# Altium schematic sheet iotv3.SchDoc
size A3
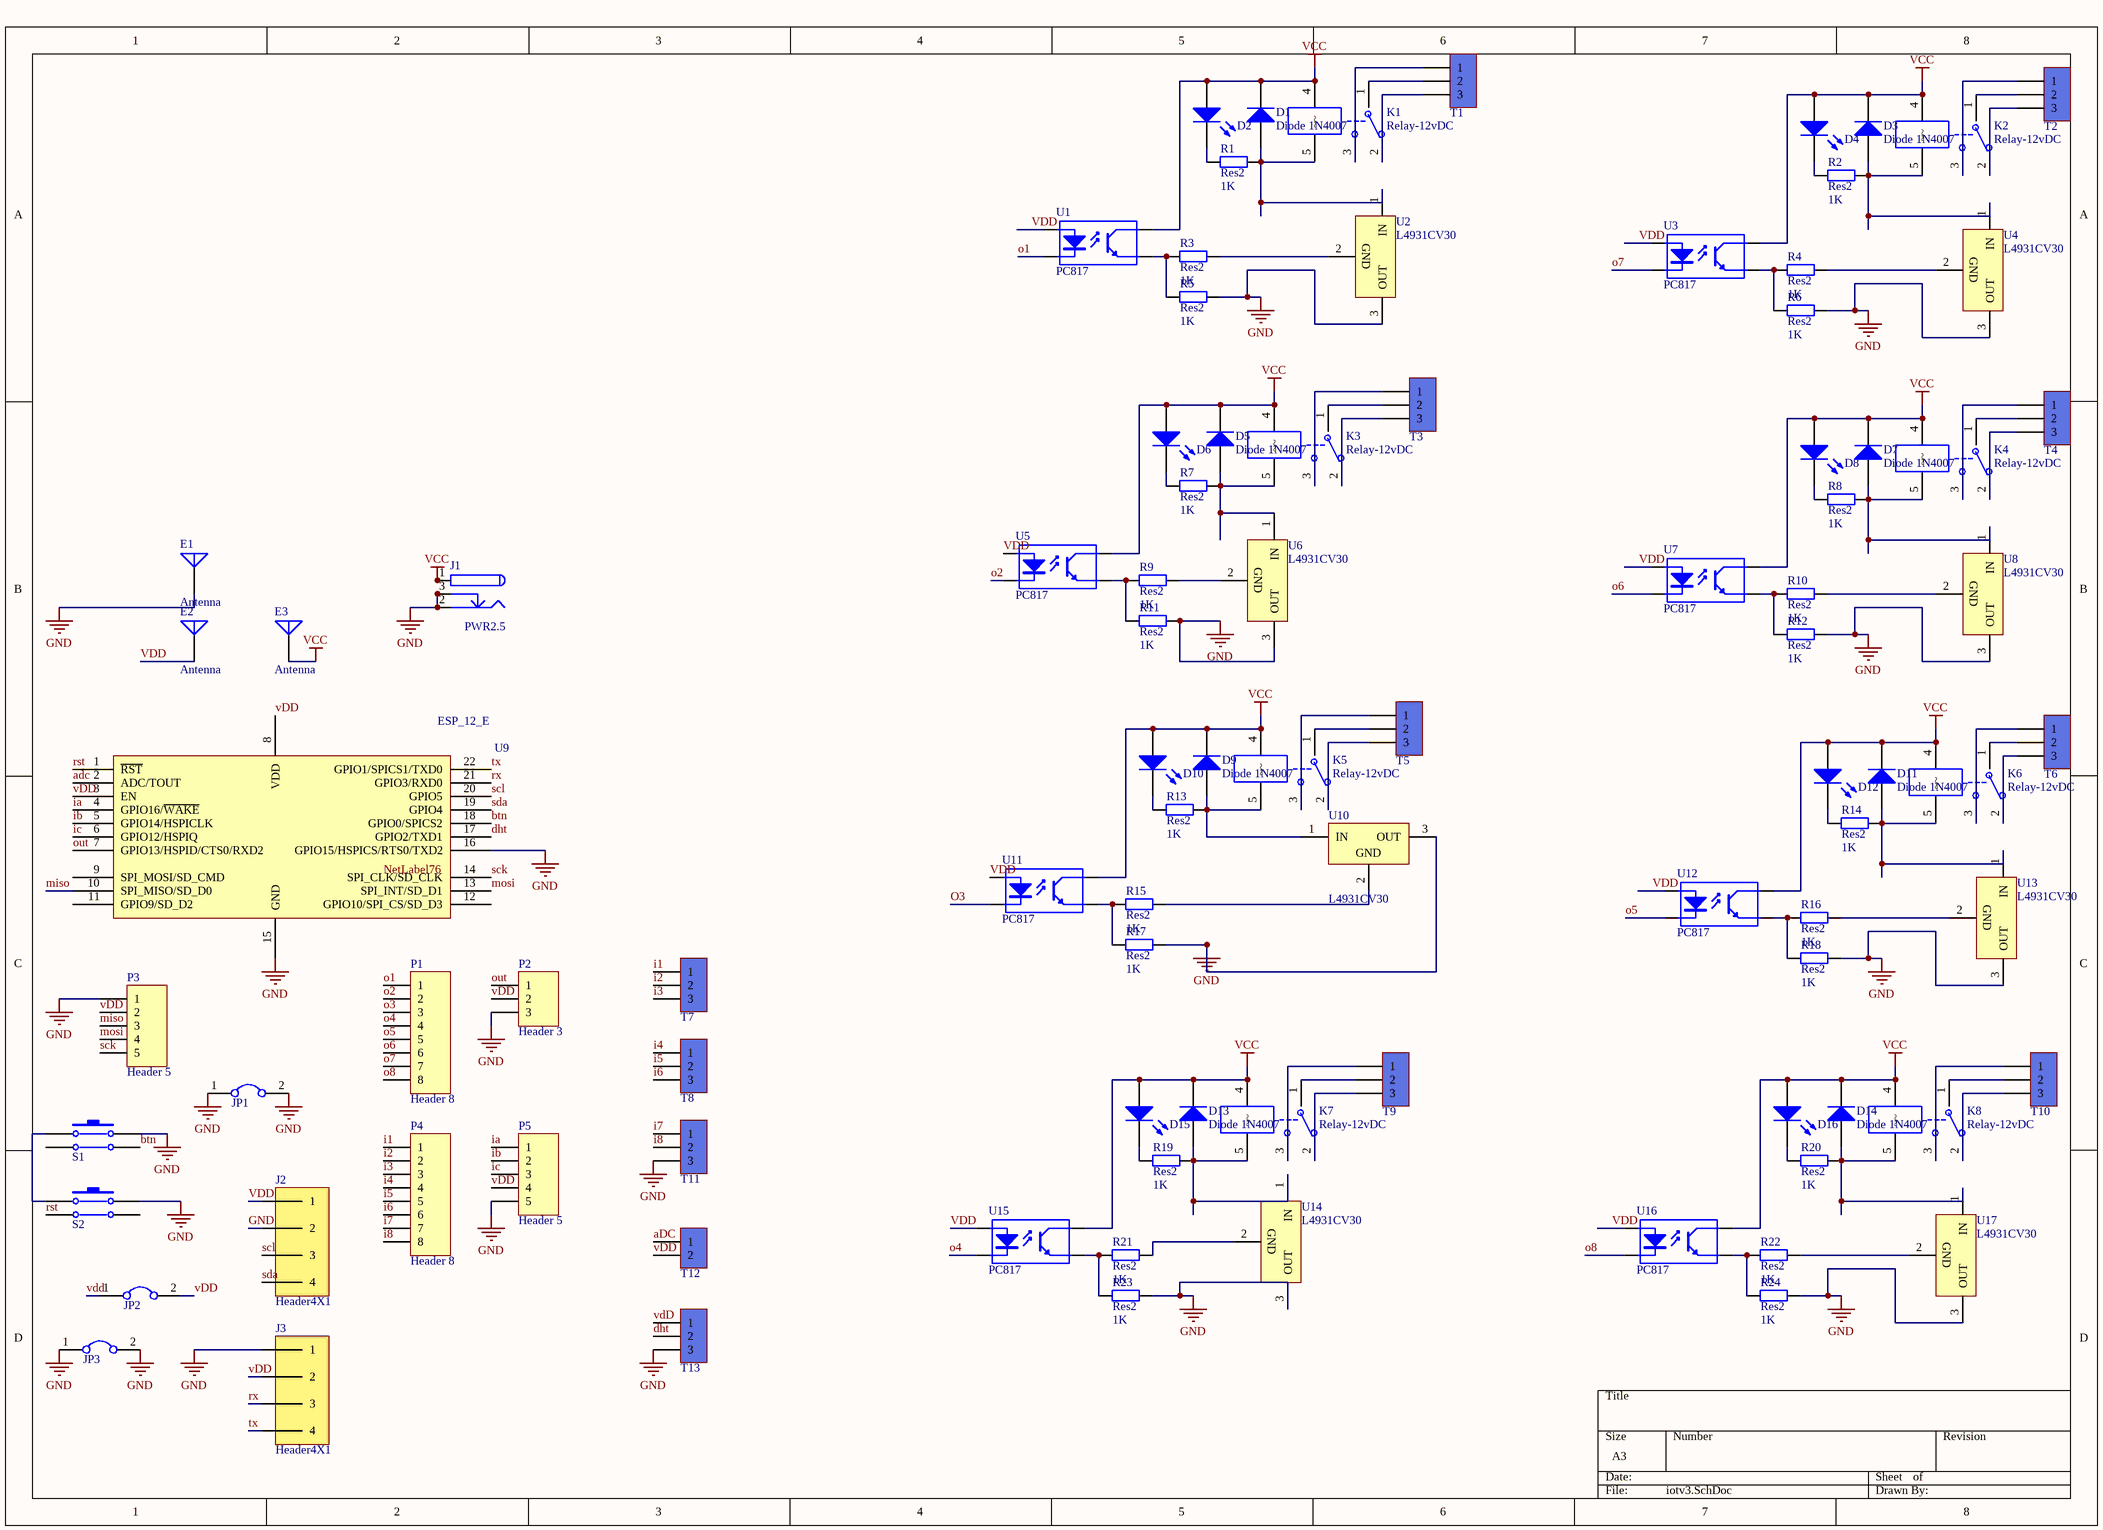
[diagram p0: iotv3.SchDoc]

## Parts
D1  Diode 1N4007  [DO-41]
D2  LED 3mm  [LED-3mm]  (value not drawn)
D3  Diode 1N4007  [DO-41]
D4  LED 3mm  [LED-3mm]  (value not drawn)
D5  Diode 1N4007  [DO-41]
D6  LED 3mm  [LED-3mm]  (value not drawn)
D7  Diode 1N4007  [DO-41]
D8  LED 3mm  [LED-3mm]  (value not drawn)
D9  Diode 1N4007  [DO-41]
D10  LED 3mm  [LED-3mm]  (value not drawn)
D11  Diode 1N4007  [DO-41]
D12  LED 3mm  [LED-3mm]  (value not drawn)
D13  Diode 1N4007  [DO-41]
D14  Diode 1N4007  [DO-41]
D15  LED 3mm  [LED-3mm]  (value not drawn)
D16  LED 3mm  [LED-3mm]  (value not drawn)
E1  Antenna  [PIN1]
E2  Antenna  [PIN1]
E3  Antenna  [PIN1]
J1  PWR2.5  [KLD-0202]
J2  Header4X1  [HEADER 4X1]
J3  Header4X1  [HEADER 4X1]
JP1  Jumper  [Header 2X1]  (value not drawn)
JP2  Jumper  [Header 2X1]  (value not drawn)
JP3  Jumper  [Header 2X1]  (value not drawn)
K1  Relay-12vDC  [Relays]
K2  Relay-12vDC  [Relays]
K3  Relay-12vDC  [Relays]
K4  Relay-12vDC  [Relays]
K5  Relay-12vDC  [Relays]
K6  Relay-12vDC  [Relays]
K7  Relay-12vDC  [Relays]
K8  Relay-12vDC  [Relays]
P1  Header 8  [HDR1X8]
P2  Header 3  [HDR1X3]
P3  Header 5  [HDR1X5]
P4  Header 8  [HDR1X8]
P5  Header 5  [HDR1X5]
R1  Res2  value 1K  [AXIAL-0.4]
R2  Res2  value 1K  [AXIAL-0.4]
R3  Res2  value 1K  [AXIAL-0.4]
R4  Res2  value 1K  [AXIAL-0.4]
R5  Res2  value 1K  [AXIAL-0.4]
R6  Res2  value 1K  [AXIAL-0.4]
R7  Res2  value 1K  [AXIAL-0.4]
R8  Res2  value 1K  [AXIAL-0.4]
R9  Res2  value 1K  [AXIAL-0.4]
R10  Res2  value 1K  [AXIAL-0.4]
R11  Res2  value 1K  [AXIAL-0.4]
R12  Res2  value 1K  [AXIAL-0.4]
R13  Res2  value 1K  [AXIAL-0.4]
R14  Res2  value 1K  [AXIAL-0.4]
R15  Res2  value 1K  [AXIAL-0.4]
R16  Res2  value 1K  [AXIAL-0.4]
R17  Res2  value 1K  [AXIAL-0.4]
R18  Res2  value 1K  [AXIAL-0.4]
R19  Res2  value 1K  [AXIAL-0.4]
R20  Res2  value 1K  [AXIAL-0.4]
R21  Res2  value 1K  [AXIAL-0.4]
R22  Res2  value 1K  [AXIAL-0.4]
R23  Res2  value 1K  [AXIAL-0.4]
R24  Res2  value 1K  [AXIAL-0.4]
S1  PUSH BUTTON DOUBLE  [PUSH BUTTON]  (value not drawn)
S2  PUSH BUTTON DOUBLE  [PUSH BUTTON]  (value not drawn)
T1  Terminal  [Terminal 1*3]  (value not drawn)
T2  Terminal  [Terminal 1*3]  (value not drawn)
T3  Terminal  [Terminal 1*3]  (value not drawn)
T4  Terminal  [Terminal 1*3]  (value not drawn)
T5  Terminal  [Terminal 1*3]  (value not drawn)
T6  Terminal  [Terminal 1*3]  (value not drawn)
T7  Terminal  [Terminal 1*3]  (value not drawn)
T8  Terminal  [Terminal 1*3]  (value not drawn)
T9  Terminal  [Terminal 1*3]  (value not drawn)
T10  Terminal  [Terminal 1*3]  (value not drawn)
T11  Terminal  [Terminal 1*3]  (value not drawn)
T12  Terminal  [Terminal 1*2]  (value not drawn)
T13  Terminal  [Terminal 1*3]  (value not drawn)
U1  PC817  [DIP4]
U2  L4931CV30  [TO-220A]
U3  PC817  [DIP4]
U4  L4931CV30  [TO-220A]
U5  PC817  [DIP4]
U6  L4931CV30  [TO-220A]
U7  PC817  [DIP4]
U8  L4931CV30  [TO-220A]
U9  ESP_12_E  [ESP_12_E]
U10  L4931CV30  [TO-220A]
U11  PC817  [DIP4]
U12  PC817  [DIP4]
U13  L4931CV30  [TO-220A]
U14  L4931CV30  [TO-220A]
U15  PC817  [DIP4]
U16  PC817  [DIP4]
U17  L4931CV30  [TO-220A]

## Nets
GND: E1.1(A) J1.2 J1.2A J1.2B J1.3 J1.3A J1.3B J2.2 J3.1 JP1.1 JP1.2 JP3.1 JP3.2 P2.3 P3.1 P5.5 R5.2 R6.2 R11.2 R12.2 R17.2 R18.2 R23.2 R24.2 S1.2 S2.2 T11.3 T13.3 U2.3(OUT) U4.3(OUT) U6.3(OUT) U8.3(OUT) U9.15(GND) U9.16(GPIO15/HSPICS/RTS0/TXD2) U10.3(OUT) U13.3(OUT) U14.3(OUT) U17.3(OUT)
VCC: D1.2(K) D2.1(A) D3.2(K) D4.1(A) D5.2(K) D6.1(A) D7.2(K) D8.1(A) D9.2(K) D10.1(A) D11.2(K) D12.1(A) D13.2(K) D14.2(K) D15.1(A) D16.1(A) E3.1(A) J1.1 J1.1A J1.1B K1.4 K2.4 K3.4 K4.4 K5.4 K6.4 K7.4 K8.4 U1.4(C) U3.4(C) U5.4(C) U7.4(C) U11.4(C) U12.4(C) U15.4(C) U16.4(C)
adc: T12.1 U9.2(ADC/TOUT)
btn: S1.4 U9.18(GPIO0/SPICS2)
dht: T13.2 U9.17(GPIO2/TXD1)
i1: P4.1 T7.1
i2: P4.2 T7.2
i3: P4.3 T7.3
i4: P4.4 T8.1
i5: P4.5 T8.2
i6: P4.6 T8.3
i7: P4.7 T11.1
i8: P4.8 T11.2
ia: P5.1 U9.4(GPIO16/~{WAKE})
ib: P5.2 U9.5(GPIO14/HSPICLK)
ic: P5.3 U9.6(GPIO12/HSPIQ)
miso: P3.3 U9.10(SPI_MISO/SD_D0)
mosi: P3.4 U9.13(SPI_INT/SD_D1)
o1: P1.1 U1.2(K)
o2: P1.2 U5.2(K)
O3: P1.3 U11.2(K)
o4: P1.4 U15.2(K)
o5: P1.5 U12.2(K)
o6: P1.6 U7.2(K)
o7: P1.7 U3.2(K)
o8: P1.8 U16.2(K)
out: P2.1 U9.7(GPIO13/HSPID/CTS0/RXD2)
rst: S2.3 U9.1(~{RST})
rx: J3.3 U9.21(GPIO3/RXD0)
sck: P3.5 U9.14(SPI_CLK/SD_CLK)
scl: J2.3 U9.20(GPIO5)
sda: J2.4 U9.19(GPIO4)
tx: J3.4 U9.22(GPIO1/SPICS1/TXD0)
VDD: E2.1(A) J2.1 J3.2 JP2.1 JP2.2 P2.2 P3.2 P5.4 T12.2 T13.1 U1.1(A) U3.1(A) U5.1(A) U7.1(A) U9.3(EN) U9.8(VDD) U11.1(A) U12.1(A) U15.1(A) U16.1(A)
NetD1_1: D1.1(A) K1.5 R1.2 U2.1(IN)
NetD2_2: D2.2(K) R1.1
NetD3_1: D3.1(A) K2.5 R2.2 U4.1(IN)
NetD4_2: D4.2(K) R2.1
NetD5_1: D5.1(A) K3.5 R7.2 U6.1(IN)
NetD6_2: D6.2(K) R7.1
NetD7_1: D7.1(A) K4.5 R8.2 U8.1(IN)
NetD8_2: D8.2(K) R8.1
NetD9_1: D9.1(A) K5.5 R13.2 U10.1(IN)
NetD10_2: D10.2(K) R13.1
NetD11_1: D11.1(A) K6.5 R14.2 U13.1(IN)
NetD12_2: D12.2(K) R14.1
NetD13_1: D13.1(A) K7.5 R19.2 U14.1(IN)
NetD14_1: D14.1(A) K8.5 R20.2 U17.1(IN)
NetD15_2: D15.2(K) R19.1
NetD16_2: D16.2(K) R20.1
NetK1_1: K1.1(COM) T1.2
NetK1_2: K1.2(NC) T1.3
NetK1_3: K1.3(NO) T1.1
NetK2_1: K2.1(COM) T2.2
NetK2_2: K2.2(NC) T2.3
NetK2_3: K2.3(NO) T2.1
NetK3_1: K3.1(COM) T3.2
NetK3_2: K3.2(NC) T3.3
NetK3_3: K3.3(NO) T3.1
NetK4_1: K4.1(COM) T4.2
NetK4_2: K4.2(NC) T4.3
NetK4_3: K4.3(NO) T4.1
NetK5_1: K5.1(COM) T5.2
NetK5_2: K5.2(NC) T5.3
NetK5_3: K5.3(NO) T5.1
NetK6_1: K6.1(COM) T6.2
NetK6_2: K6.2(NC) T6.3
NetK6_3: K6.3(NO) T6.1
NetK7_1: K7.1(COM) T9.2
NetK7_2: K7.2(NC) T9.3
NetK7_3: K7.3(NO) T9.1
NetK8_1: K8.1(COM) T10.2
NetK8_2: K8.2(NC) T10.3
NetK8_3: K8.3(NO) T10.1
NetR3_1: R3.1 R5.1 U1.3(E)
NetR3_2: R3.2 U2.2(GND)
NetR4_1: R4.1 R6.1 U3.3(E)
NetR4_2: R4.2 U4.2(GND)
NetR9_1: R9.1 R11.1 U5.3(E)
NetR9_2: R9.2 U6.2(GND)
NetR10_1: R10.1 R12.1 U7.3(E)
NetR10_2: R10.2 U8.2(GND)
NetR15_1: R15.1 R17.1 U11.3(E)
NetR15_2: R15.2 U10.2(GND)
NetR16_1: R16.1 R18.1 U12.3(E)
NetR16_2: R16.2 U13.2(GND)
NetR21_1: R21.1 R23.1 U15.3(E)
NetR21_2: R21.2 U14.2(GND)
NetR22_1: R22.1 R24.1 U16.3(E)
NetR22_2: R22.2 U17.2(GND)
NetS1_1: S1.1 S2.1

Not connected (* = marked no-connect by the designer): S1 3; S2 4; U9 9(SPI_MOSI/SD_CMD) 11(GPIO9/SD_D2) 12(GPIO10/SPI_CS/SD_D3)

## Notes on the sheet
- Labels drawn without touching a wire or pin: NetLabel76

## Library data of the parts
D1 D3 D5 D7 D9 D11 D13 D14 = Diode 1N4007: 1 Amp General Purpose Rectifier; Published: 8-Jun-2000; LatestRevisionDate: 17-Jul-2002; LatestRevisionNote: Re-released for DXP Platform.; DatasheetVersion: 1998; PackageVersion: Aug-1999; PackageReference: DO-41; Publisher: Altium Limited; PackageDescription: Diode, Axial; Body 5.2 x 2.7 mm (LxDia. max), Lead Dia. 0.86 mm (max); Code_JEDEC: DO-204-AL; ComponentLink1Description: Manufacturer Link; ComponentLink1URL: http://www.fairchildsemi.com/; ComponentLink2Description: Datasheet; ComponentLink2URL: http://www.fairchildsemi.com/ds/1N%2F1N4001.pdf
D2 D4 D6 D8 D10 D12 D15 D16 = LED 3mm: Typical LED; Designer: Seyed Mohsen Ghasemian; Published: 02/04/2012; PackageReference: LED; Publisher: www.picpars.com; PackageDescription: LED; 2 Leads
E1-E3 = Antenna: Generic Antenna; Published: 24-Mar-1999; LatestRevisionDate: 17-Jul-2002; LatestRevisionNote: Re-released for DXP Platform.; PackageReference: PIN1; Publisher: Altium Limited
J1 = PWR2.5: Low Voltage Power Supply Connector; Published: 17-Dec-2003; DatasheetDocument: 09-May-2002; Publisher: Altium Limited; ComponentLink1Description: Manufacturer Link; ComponentLink1URL: http://domino.kycon.com/internet/Products.html
K1-K8 = Relay-05vDC: Relay-05vDC-240AC 5A; Designer: Seyed Mohsen Ghasemain; ComponentLinkURL: www.picpars.com
P1 P4 = Header 8: Header, 8-Pin; LatestRevisionDate: 17-Jul-2002; LatestRevisionNote: Re-released for DXP Platform.; Publisher: Altium Limited
P2 = Header 3: Header, 3-Pin; LatestRevisionDate: 17-Jul-2002; LatestRevisionNote: Re-released for DXP Platform.; Publisher: Altium Limited
P3 P5 = Header 5: Header, 5-Pin; LatestRevisionDate: 17-Jul-2002; LatestRevisionNote: Re-released for DXP Platform.; Publisher: Altium Limited
R1-R24 = Res2: Resistor; Published: 8-Jun-2000; LatestRevisionDate: 17-Jul-2002; LatestRevisionNote: Re-released for DXP Platform.; PackageReference: AXIAL-0.4; Publisher: Altium Limited; PackageDescription: Axial Device, Thru-Hole; 2 Leads; 0.4 in Pin Spacing
S1 S2 = PUSH BUTTON DOUBLE: Switch
T1-T11 T13 = Terminal 1*3: Terminal 3 Pin 250VAC 16A; Designer: Seyed Mohsen Ghasemain; E-mail: picpars@gmail.com; ComponentLinkURL: www.picpars.com
T12 = Terminal 1*2: Terminal 2 Pin 250VAC 16A; Designer: Seyed Mohsen Ghasemain; E-mail: picpars@gmail.com; ComponentLinkURL: www.picpars.com
U1 U3 U5 U7 U11 U12 U15 U16 = OPTCOUPLER_01: 4-Pin Phototransistor Optocoupler
U2 U4 U6 U8 U10 U13 U14 U17 = L4931CV30: 250mA, Very Low Drop ( 0.4V) Voltage Regulator; Published: 24-Aug-2001; LatestRevisionDate: 06-Jun-2005; LatestRevisionNote: PCB Pin sequence re-ordered.; DatasheetVersion: Apr-1999; PackageVersion: Jul-2004; PackageReference: TO-220A; Publisher: Altium Limited; PackageDescription: TO, Thru-Hole, Vertical, Heatsink Mounted; 3 In-Line Leads; Pitch 2.54 mm; ComponentLink1Description: Manufacturer Link; ComponentLink1URL: http://www.st.com/; ComponentLink2Description: Datasheet; ComponentLink2URL: http://www.st.com/stonline/products/literature/ds/4340/l4931abxx15.pdf
U9 = ESP_12_E: ESP-12 Wi-Fi Module by AI-Thinker; IC: ESP8266-EX; Vendor: Ai-thinker